# EasyEDA Pro project ProPrj_ProDoc_FPGA_2026-03-24.epro, board 逻辑派_demo
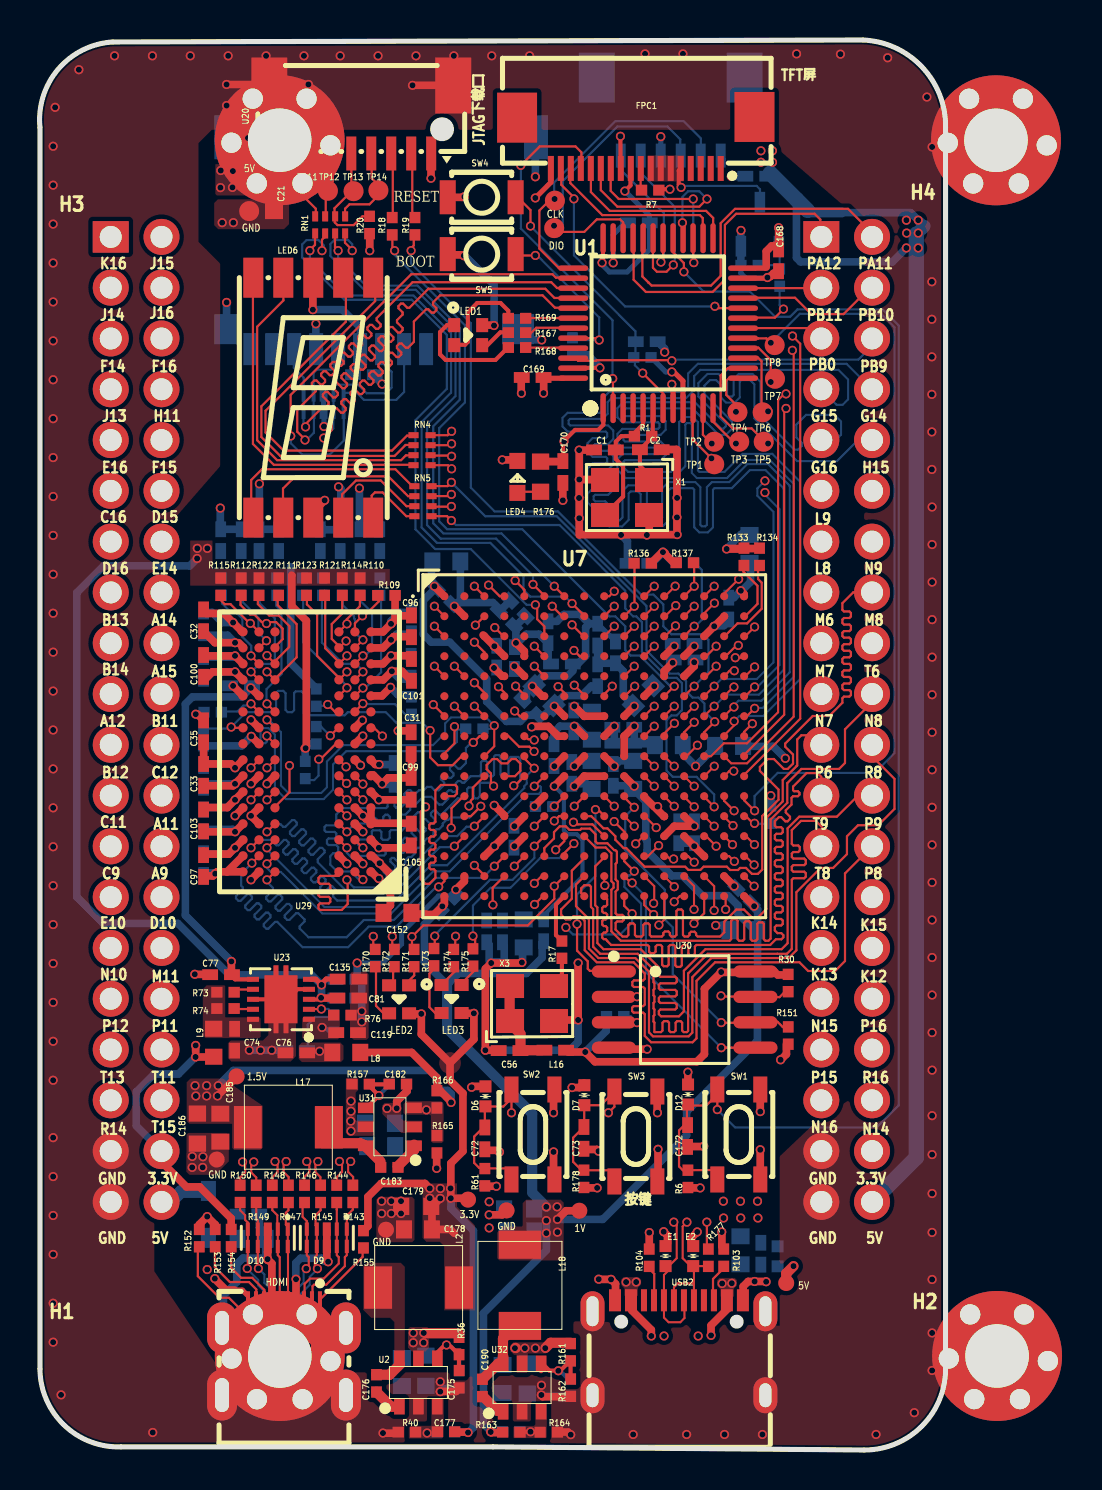
[diagram p11: board, top side]
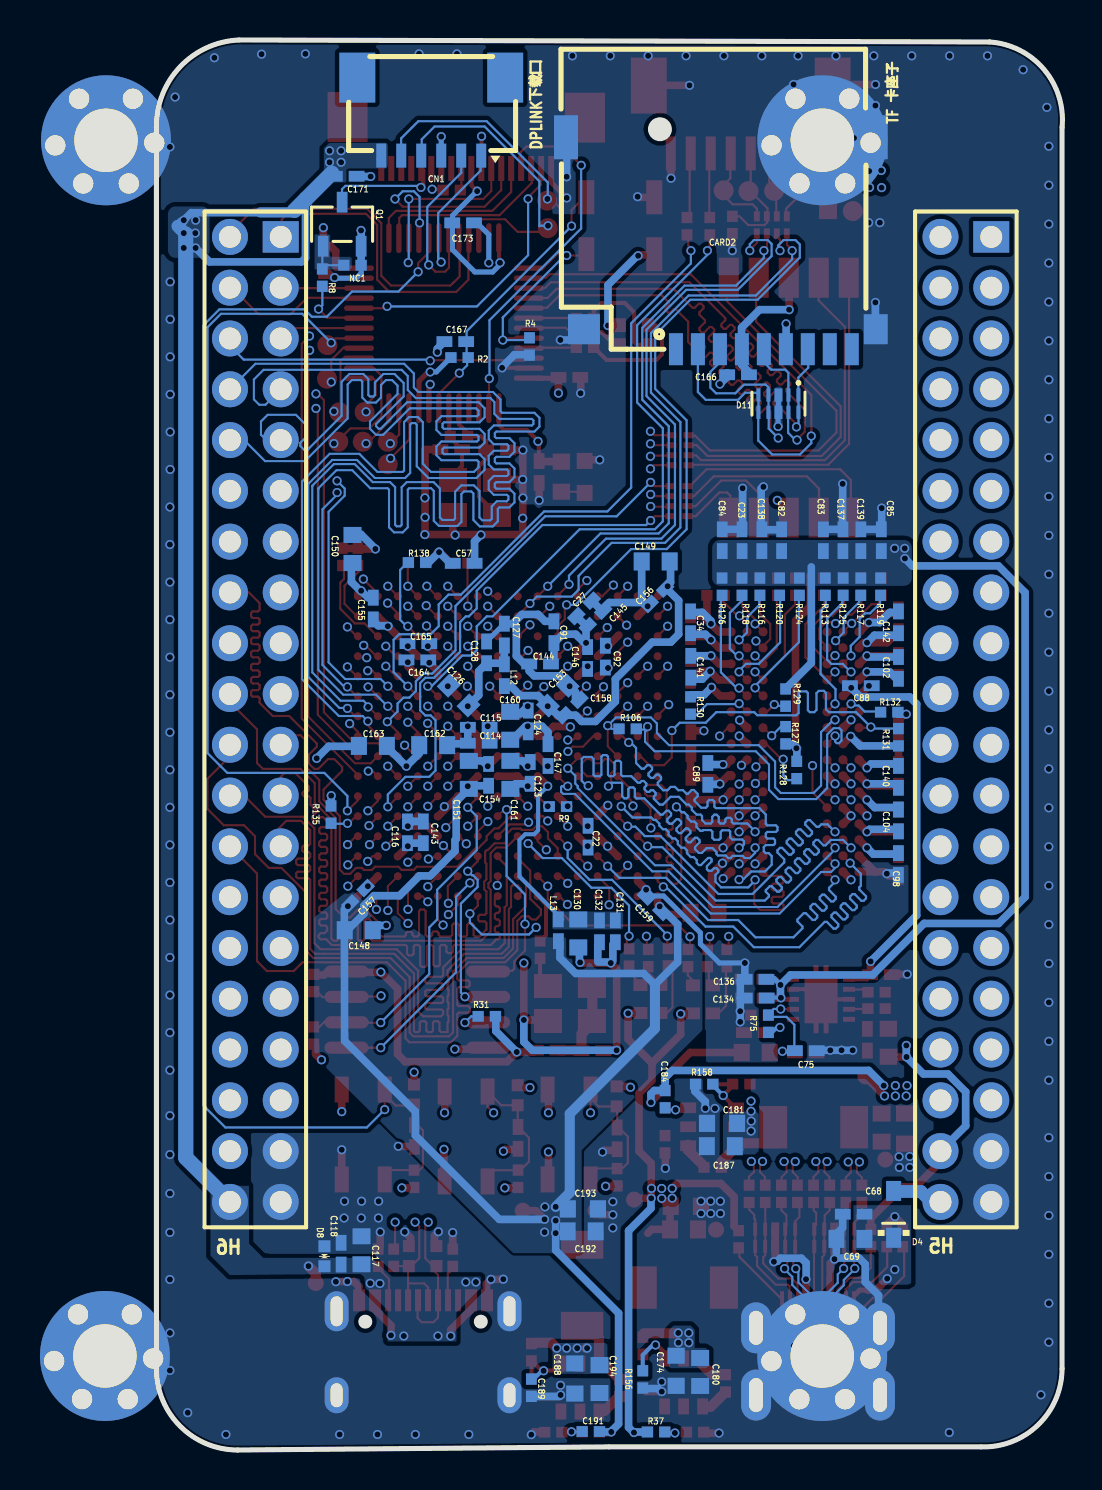
[diagram p12: board, bottom side, seen from below]

Outline 45.32 x 70.52 mm; copper layers: Top Layer, GND02, SIG03, SIG04, POWER05, Bottom Layer. Coordinates in mm from the lower left corner of the outline.
Outline path: 0,66.14 0,4.06 arc(1.2,1.25) 4.05,0.16 22.66,0.16 41.25,0 arc(44.13,1.19) 45.32,4.06 45.32,66.14 arc(44.13,69.17) 41.18,70.52 3.63,70.42 arc(0.91,69.05) 0,66.14
Stack: Top Layer 0.035mm 外层铜厚1oz / Dielectric1 0.0994mm 3313 RC57% 4.2mil / GND02 0.0152mm 内层铜厚 / Dielectric2 0.55mm 0.55mm H/H No copper / SIG03 0.0152mm 内层铜厚 / Dielectric3 0.1088mm 2116 RC54% 4.9mil / SIG04 0.0152mm 内层铜厚 / Dielectric4 0.55mm 0.55mm H/H No copper / POWER05 0.0152mm 内层铜厚 / Dielectric5 0.0994mm 3313 RC57% 4.2mil / Bottom Layer 0.035mm 外层铜厚1oz

## Design rules (mm)
net GND: power
net +5V_IN: power
net +3.3V: power
net VTT_DRAM: power
net +1.5V: power
net HDMI_5V: power
net VREF_DRAM: power
net VCCPLLL: power
net VCCPLLR: power
net +1.0V: power
net PB4/SPI2_MISO: TF_SPI
net PB3/SPI2_SCK: TF_SPI
net PB5/SPI2_MOSI: TF_SPI
net PA15/SPI2_NSS: TF_SPI
net HDMI_DATA2_P: HDMI_DATA2_
net HDMI_DATA2_N: HDMI_DATA2_
net HDMI_DATA1_P: HDMI_DATA1_
net HDMI_DATA1_N: HDMI_DATA1_
net HDMI_DATA0_P: HDMI_DATA0_
net HDMI_DATA0_N: HDMI_DATA0_
net HDMI_CLK_P: HDMI_CLK_
net HDMI_CLK_N: HDMI_CLK_
net M15_IOT40B: USB, USB
net M14_IOT40A: USB, USB
net EX_IOT24B_K16: BANK0, FPGA_IOT24
net EX_IOT24A_J15: BANK0, FPGA_IOT24
net EX_IOT22B_J14: BANK0, FPGA_IOT22
net EX_IOT22A_J16: BANK0, FPGA_IOT22
net EX_IOT9A_F14: BANK0, FPGA_IOT9
net EX_IOT9B_F16: BANK0, FPGA_IOT9
net EX_IOT27B_J13: BANK0, FPGA_IOT27
net EX_IOT27A_H11: BANK0, FPGA_IOT27
net EX_IOT6A_E16: BANK0, FPGA_IOT6
net EX_IOT6B_F15: BANK0, FPGA_IOT6
net EX_IOT5A_C16: BANK0, FPGA_IOT5
net EX_IOT5B_D15: BANK0, FPGA_IOT5
net EX_IOT4A_D16: BANK0, FPGA_IOT4
net EX_IOT4B_E14: BANK0, FPGA_IOT4
net EX_IOL8A_B13: BANK7, FPGA_IOL8
net EX_IOL8B_A14: BANK7, FPGA_IOL8
net EX_IOL2A_B14: BANK7, FPGA_IOL2
net EX_IOL2B_A15: BANK7, FPGA_IOL2
net EX_IOL13B_A12: BANK7, FPGA_IOL13
net EX_IOL13A_B11: BANK7, FPGA_IOL13
net EX_IOL7B_B12: BANK7, FPGA_IOL7
net EX_IOL7A_C12: BANK7, FPGA_IOL7
net EX_IOL15B_C11: BANK7, FPGA_IOL15
net EX_IOL15A_A11: BANK7, FPGA_IOL15
net EX_IOL27B_C9: BANK7, FPGA_IOL27
net EX_IOL27A_A9: BANK7, FPGA_IOL27
net EX_IOL17B_E10: BANK7, FPGA_IOL17
net EX_IOL17A_D10: BANK7, FPGA_IOL17
net EX_IOR27A_N10: BANK2, FPGA_IOR27
net EX_IOR27B_M11: BANK2, FPGA_IOR27
net EX_IOR8A_P12: BANK2, FPGA_IOR8
net EX_IOR24B_P11: BANK2, FPGA_IOR24
net EX_IOR8B_T13: BANK2, FPGA_IOR8
net EX_IOR24A_T11: BANK2, FPGA_IOR24
net EX_IOR7B_R14: BANK2, FPGA_IOR7
net EX_IOR7A_T15: BANK2, FPGA_IOR7
net EX_IOT13A_G15: BANK0, FPGA_IOT13
net EX_IOT13B_G14: BANK0, FPGA_IOT13
net EX_IOT16A_G16: BANK0, FPGA_IOT16
net EX_IOT16B_H15: BANK0, FPGA_IOT16
net EX_IOR40B_L9: BANK3
net EX_IOR44B_L8: BANK3
net EX_IOR36B_N9: BANK3
net EX_IOR44A_M6: BANK3
net EX_IOR36A_M8: BANK3
net EX_IOR47A_M7: BANK3
net EX_IOR53B_T6: BANK3
net EX_IOR47B_N7: BANK3
net EX_IOR40A_N8: BANK3
net EX_IOR53A_P6: BANK3
net EX_IOR29B_R8: BANK3
net EX_IOR38A_T9: BANK3
net EX_IOR38B_P9: BANK3
net EX_IOR42B_T8: BANK3
net EX_IOR42A_P8: BANK3
net EX_IOT30A_K14: BANK1, FPGA_IOT30
net EX_IOT30B_K15: BANK1, FPGA_IOT30
net EX_IOT36A_K13: BANK1, FPGA_IOT36
net EX_IOT36B_K12: BANK1, FPGA_IOT36
net EX_IOT48A_N15: BANK1, FPGA_IOT48
net EX_IOT48B_P16: BANK1, FPGA_IOT48
net EX_IOT54A_P15: BANK1, FPGA_IOT54
net EX_IOT54B_R16: BANK1, FPGA_IOT54
net EX_IOT52A_N16: BANK1, FPGA_IOT52
net EX_IOT52B_N14: BANK1, FPGA_IOT52
net DDR3_CKN: ADDR, DDR3_CK
net DDR3_CKP: ADDR, DDR3_CK
net DDR3_RSTN: ADDR
net DDR3_A13: ADDR
net DDR3_A12: ADDR
net DDR3_A11: ADDR
net DDR3_A10: ADDR
net DDR3_A9: ADDR
net DDR3_A8: ADDR
net DDR3_A7: ADDR
net DDR3_A6: ADDR
net DDR3_A5: ADDR
net DDR3_A4: ADDR
net DDR3_A3: ADDR
net DDR3_A2: ADDR
net DDR3_A1: ADDR
net DDR3_A0: ADDR
net DDR3_BA2: ADDR
net DDR3_BA1: ADDR
net DDR3_BA0: ADDR
net DDR3_CASN: ADDR
net DDR3_RASN: ADDR
net DDR3_WEN: ADDR
net DDR3_CSN: ADDR
net DDR3_CK_EN: ADDR
net LVDS_IOR11_P: LVDS, LVDS_IOR11_
net LVDS_IOR11_N: LVDS, LVDS_IOR11_
net LVDS_IOR17_P: LVDS, LVDS_IOR17_
net LVDS_IOR17_N: LVDS, LVDS_IOR17_
net LVDS_IOR20_P: LVDS, LVDS_IOR20_
net LVDS_IOR20_N: LVDS, LVDS_IOR20_
net LVDS_IOR22_P: LVDS, LVDS_IOR22_
net LVDS_IOR22_N: LVDS, LVDS_IOR22_
net DDR3_DQ5: DQ0-7
net DDR3_DQ6: DQ0-7
net DDR3_LDM: DQ0-7
net DDR3_DQ11: DQ8-15
net DDR3_DQ14: DQ8-15
net DDR3_DQ4: DQ0-7
net DDR3_LDQSP: DQ0-7, DDR3_LDQS
net DDR3_DQ15: DQ8-15
net DDR3_DQ10: DQ8-15
net DDR3_DQ7: DQ0-7
net DDR3_DQ3: DQ0-7
net DDR3_LDQSN: DQ0-7, DDR3_LDQS
net DDR3_DQ13: DQ8-15
net DDR3_DQ8: DQ8-15
net DDR3_ODT: ADDR
net DDR3_DQ2: DQ0-7
net DDR3_DQ9: DQ8-15
net DDR3_DQ12: DQ8-15
net DDR3_DQ1: DQ0-7
net DDR3_DQ0: DQ0-7
net DDR3_UDQSP: DQ8-15, DDR3_UDQS
net DDR3_UDM: DQ8-15
net DDR3_UDQSN: DQ8-15, DDR3_UDQS
template: 自定义配置
spacing copperThickness1oz (default): track to track 0.102, other pairs 0.102 to 0.381
spacing 3W: track to track 0.218, other pairs 0.076 to 0.3
spacing TF: track to track 0.152, other pairs 0 to 0.3
track width 50ohm (default): min 0.109, default 0.109, max 0.508
track width PWOER: min 0.127, default 0.381, max 2.54
differential pair 90ohm: width min 0.102, default 0.102, max 0.109; gap min 0.135, default 0.135
differential pair 100ohm (default): width min 0.104, default 0.104, max 0.104; gap min 0.201, default 0.201
via viaSize (default): diameter min 0.254, default 0.457, max 0.457; hole min 0.178, default 0.305, max 0.305
net class power uses PWOER
net class TF_SPI uses 3W
net class ADDR uses 3W
net class DQ0-7 uses 3W
net class DQ8-15 uses 3W
net GND uses PWOER
net +5V_IN uses PWOER
net +3.3V uses PWOER
net VTT_DRAM uses PWOER
net +1.5V uses PWOER
net HDMI_5V uses PWOER
net VREF_DRAM uses PWOER
net VCCPLLL uses PWOER
net VCCPLLR uses PWOER
net +1.0V uses PWOER
net PB4/SPI2_MISO uses 3W
net PB3/SPI2_SCK uses 3W
net PB5/SPI2_MOSI uses 3W
net PA15/SPI2_NSS uses 3W
net M15_IOT40B uses 90ohm
net M14_IOT40A uses 90ohm
net DDR3_CKN uses 3W
net DDR3_CKP uses 3W
net DDR3_RSTN uses 3W
net DDR3_A13 uses 3W
net DDR3_A12 uses 3W
net DDR3_A11 uses 3W
net DDR3_A10 uses 3W
net DDR3_A9 uses 3W
net DDR3_A8 uses 3W
net DDR3_A7 uses 3W
net DDR3_A6 uses 3W
net DDR3_A5 uses 3W
net DDR3_A4 uses 3W
net DDR3_A3 uses 3W
net DDR3_A2 uses 3W
net DDR3_A1 uses 3W
net DDR3_A0 uses 3W
net DDR3_BA2 uses 3W
net DDR3_BA1 uses 3W
net DDR3_BA0 uses 3W
net DDR3_CASN uses 3W
net DDR3_RASN uses 3W
net DDR3_WEN uses 3W
net DDR3_CSN uses 3W
net DDR3_CK_EN uses 3W
net LVDS_IOR11_P uses LVDS
net LVDS_IOR11_N uses LVDS
net LVDS_IOR17_P uses LVDS
net LVDS_IOR17_N uses LVDS
net LVDS_IOR20_P uses LVDS
net LVDS_IOR20_N uses LVDS
net LVDS_IOR22_P uses LVDS
net LVDS_IOR22_N uses LVDS
net DDR3_DQ5 uses 3W, DQ0_7
net DDR3_DQ6 uses 3W, DQ0_7
net DDR3_LDM uses 3W, DQ0_7
net DDR3_DQ11 uses 3W, DQ8_15
net DDR3_DQ14 uses 3W, DQ8_15
net DDR3_DQ4 uses 3W, DQ0_7
net DDR3_LDQSP uses 3W, DQ0_7
net DDR3_DQ15 uses 3W, DQ8_15
net DDR3_DQ10 uses 3W, DQ8_15
net DDR3_DQ7 uses 3W, DQ0_7
net DDR3_DQ3 uses 3W, DQ0_7
net DDR3_LDQSN uses 3W, DQ0_7
net DDR3_DQ13 uses 3W, DQ8_15
net DDR3_DQ8 uses 3W, DQ8_15
net DDR3_ODT uses 3W
net DDR3_DQ2 uses 3W, DQ0_7
net DDR3_DQ9 uses 3W, DQ8_15
net DDR3_DQ12 uses 3W, DQ8_15
net DDR3_DQ1 uses 3W, DQ0_7
net DDR3_DQ0 uses 3W, DQ0_7
net DDR3_UDQSP uses 3W, DQ8_15
net DDR3_UDM uses 3W, DQ8_15
net DDR3_UDQSN uses 3W, DQ8_15
diff pair USB uses 90ohm
eq len grp LVDS uses LVDS
eq len grp DQ0_7 uses DQ0_7
eq len grp DQ8_15 uses DQ8_15
region e31913 uses TF
region e31914 uses TF

## Placement (name value [footprint] x y rotation side)
C1  18pF  [C0402]  28.27 50.02 180 top
C2  18pF  [C0402]  30.56 50.03 180 top
C21  22uF  [C0603]  11.71 62.66 90 top
C22  100nF  [C0402]  23.72 30.67 270 bottom
C23  100nF  [C0402]  16.01 45.5 90 bottom
C27  100nF  [C0402]  23.92 42.09 315 bottom
C31  100nF  [C0402]  18.57 35.35 90 top
C32  100nF  [C0402]  8.19 41.49 270 top
C33  100nF  [C0402]  8.19 33.76 90 top
C34  100nF  [C0402]  18.59 41.39 270 bottom
C35  100nF  [C0402]  8.19 35.94 270 top
C56  100nF  [C0402]  23.5 19.97 0 top
C57  100nF  [C0402]  29.94 44.34 180 bottom
C68  100nF  [C0402]  10.43 11.79 0 bottom
C69  10uF  [C0603]  10.59 10.56 180 bottom
C72  100nF  [C0402]  22.26 15.58 270 top
C73  100nF  [C0402]  27.22 15.61 270 top
C74  2.2uF  [C0402]  9.74 20.52 270 top
C75  10uF  [C0402]  12.82 19.97 0 bottom
C76  10uF  [C0402]  12.83 19.86 0 top
C77  100nF  [C0402]  9.06 23.77 180 top
C81  2.2uF  [C0402]  15.43 22.6 180 top
C82  2.2uF  [C0402]  14.03 45.5 270 bottom
C83  2.2uF  [C0402]  11.94 45.5 270 bottom
C84  100nF  [C0402]  17 45.5 90 bottom
C85  100nF  [C0402]  9.04 45.5 90 bottom
C88  100nF  [C0402]  10.07 38.22 180 bottom
C89  100nF  [C0402]  17.72 33.81 270 bottom
C91  100nF  [C0402]  25.42 40.9 270 bottom
C92  100nF  [C0402]  22.85 39.68 270 bottom
C96  2.2uF  [C0402]  18.59 41.19 270 top
C97  2.2uF  [C0402]  8.19 29.21 90 top
C98  2.2uF  [C0402]  8.19 29.31 90 bottom
C99  2.2uF  [C0402]  18.57 33.07 270 top
C100  100nF  [C0402]  8.19 39.21 270 top
C101  100nF  [C0402]  18.59 39.01 270 top
C102  100nF  [C0402]  8.19 39.11 270 bottom
C103  100nF  [C0402]  8.19 31.48 270 top
C104  100nF  [C0402]  8.19 31.48 270 bottom
C105  100nF  [C0402]  18.58 30.78 270 top
C114  100nF  [C0402]  29.19 35.35 0 bottom
C115  100nF  [C0402]  29.19 36.14 0 bottom
C116  100nF  [C0402]  32.75 30.89 90 bottom
C117  22uF  [C0603]  35.06 9.99 270 bottom
C118  100nF  [C0402]  36.07 9.82 270 bottom
C119  1nF  [C0402]  15.37 20.87 180 top
C123  100nF  [C0402]  26.61 33.86 270 bottom
C124  100nF  [C0402]  26.71 36.44 90 bottom
C126  10uF  [C0603]  30.19 37.73 225 bottom
C127  1nF  [C0402]  27.91 40.78 270 bottom
C128  100nF  [C0402]  28.8 39.89 270 bottom
C130  10uF  [C0603]  24.21 25.83 90 bottom
C131  1nF  [C0402]  22.35 25.94 90 bottom
C132  100nF  [C0402]  23.15 25.94 90 bottom
C134  10uF  [C0402]  15.33 22.6 180 bottom
C135  10uF  [C0402]  15.44 23.55 180 top
C136  10uF  [C0402]  15.34 23.54 180 bottom
C137  100nF  [C0402]  10.96 45.5 90 bottom
C138  100nF  [C0402]  15.02 45.5 90 bottom
C139  100nF  [C0402]  10.07 45.5 90 bottom
C140  100nF  [C0402]  8.19 33.66 90 bottom
C141  100nF  [C0402]  18.57 39.17 270 bottom
C142  100nF  [C0402]  8.19 41.39 270 bottom
C143  100nF  [C0402]  31.96 30.89 90 bottom
C144  100nF  [C0402]  26.12 39.31 180 bottom
C145  100nF  [C0402]  23.34 41.59 315 bottom
C146  100nF  [C0402]  23.74 39.61 90 bottom
C147  100nF  [C0402]  25.72 34.75 270 bottom
C148  22uF  [C0603]  35.19 26 0 bottom
C149  22uF  [C0603]  20.33 44.44 180 bottom
C150  22uF  [C0603]  35.51 45.06 270 bottom
C151  10uF  [C0603]  29.68 33.76 270 bottom
C152  10uF  [C0603]  17.89 26.86 0 top
C153  10uF  [C0603]  25.23 37.73 315 bottom
C154  100nF  [C0402]  28.69 33.76 270 bottom
C155  100nF  [C0402]  34.47 42.08 90 bottom
C156  100nF  [C0402]  20.25 42.7 135 bottom
C157  100nF  [C0402]  35.23 27.72 315 bottom
C158  100nF  [C0402]  24.53 37.13 315 bottom
C159  100nF  [C0402]  20.44 27.29 225 bottom
C160  22uF  [C0603]  27.61 36.22 90 bottom
C161  22uF  [C0603]  27.6 33.76 270 bottom
C162  10uF  [C0603]  31.47 35.25 180 bottom
C163  10uF  [C0603]  34.49 35.21 0 bottom
C164  100nF  [C0402]  32.26 39.51 0 bottom
C165  100nF  [C0402]  32.21 40.33 180 bottom
C166  100nF  [C0402]  16.21 53.77 180 bottom
C167  100nF  [C0402]  30.36 55.43 180 bottom
C168  100nF  [C0402]  36.96 59.5 90 top
C169  100nF  [C0402]  24.65 53.64 0 top
C170  100nF  [C0402]  26.17 48.91 90 top
C171  100nF  [C0402]  35.84 63.7 0 bottom
C172  100nF  [C0402]  32.41 15.7 90 top
C173  100nF  [C0402]  29.97 61.37 0 bottom
C174  100nF  [R0603_1]  19.31 3.96 90 bottom
C175  100nF  [R0402_1]  20.98 3.54 90 top
C176  100nF  [R0402_1]  16.84 3.33 270 top
C177  22pF  [R0402_1]  20.32 0.92 0 top
C178  22uF  [C0603_1]  18.92 11.03 0 top
C179  100nF  [R0603_1]  18.83 12.19 0 top
C180  10uF  [C0603]  18.11 3.9 90 bottom
C181  100nF  [R0603_1]  17.01 16.34 180 bottom
C182  100nF  [R0402_1]  17.91 18.3 180 top
C183  100nF  [R0402_1]  17.48 14.14 0 top
C184  22pF  [R0402_1]  19.86 17.55 90 bottom
C185  22uF  [C0603_1]  9.03 16.12 90 top
C186  100nF  [R0603_1]  7.88 16.07 90 top
C187  10uF  [C0603]  17.07 15.19 180 bottom
C188  100nF  [R0603_1]  24.38 3.58 90 bottom
C189  100nF  [R0402_1]  26.55 3.12 90 bottom
C190  100nF  [R0402_1]  22.14 3.1 270 top
C191  22pF  [R0402_1]  23.58 0.93 180 bottom
C192  22uF  [C0603_1]  24.04 10.94 0 bottom
C193  100nF  [R0603_1]  23.98 12.06 0 bottom
C194  10uF  [C0603]  23.15 3.55 90 bottom
CARD2  TF PUSH  [TF-SMD_TF-PUSH]  17.07 60.35 0 bottom
CN1  WAFER-100W-6A  [CONN-SMD_6P-P1.00_XUNPU_WAFER-100W-6P]  31.56 66.68 0 bottom
D4  1N5819WS  [SOD-323_L1.8-W1.3-LS2.5-RD]  8.43 11.78 90 bottom
D6  0402ESDA-05N  [D0402-BI]  22.29 17.68 270 top
D7  0402ESDA-05N  [D0402-BI]  27.24 17.74 270 top
D8  0402ESDA-05N  [D0402-BI]  36.91 9.69 270 bottom
D9  RCLAMP0524P  [DFN2510-10_L2.5-W1.0-P0.50-BL]  14.35 10.61 180 top
D10  RCLAMP0524P  [DFN2510-10_L2.5-W1.0-P0.50-BL]  11.4 10.61 180 top
D11  RCLAMP0524P  [DFN2510-10_L2.5-W1.0-P0.50-BL]  14.19 52.33 0 bottom
D12  0402ESDA-05N  [D0402-BI]  32.43 17.78 270 top
E1  0402ESDA-05N  [D0402-BI]  31.3 9.7 270 top
E2  0402ESDA-05N  [D0402-BI]  32.69 9.7 270 top
FPC1  FPC-05F-18PH20  [FPC-SMD_18P-P0.50_FPC-05F-18PH20]  29.81 65.38 180 top
H1  -  [125 X 300]  4.64 4.7 0 top
H2  -  [125 X 300]  40.53 4.7 0 top
H3  -  [125 X 300]  4.63 65.5 0 top
H4  -  [125 X 300]  40.48 65.5 0 top
H5  12251220ANG0S115001  [HDR-TH_40P-P2.54-V-M-R2-C20-S2.54]  4.81 36.54 270 top
H6  12251220ANG0S115001  [HDR-TH_40P-P2.54-V-M-R2-C20-S2.54]  40.37 36.54 270 top
L2  3.3uH  [IND-SMD_L4.4-W4.2]  18.95 8.12 180 top
L8  MPZ1608S101ATAH0  [L0603]  15.33 19.88 0 top
L9  MPZ1608S101ATAH0  [L0603]  8.69 20.37 270 top
L12  UPZ1005D121-1R3TF  [L0402]  27.91 38.75 90 bottom
L13  UPZ1005D121-1R3TF  [L0402]  25.2 25.99 90 bottom
L16  UPZ1005D121-1R3TF  [L0402]  25.78 19.99 180 top
L17  3.3uH  [IND-SMD_L4.4-W4.2]  12.43 16.14 0 top
L18  3.3uH  [IND-SMD_L4.4-W4.2]  24.02 8.23 270 top
LED1  E6C0606RGBC3UDA  [LED-SMD_4P-L1.6-W1.6-TL-FD]  21.43 55.76 0 top
LED2  E6C0606RGBC3UDA  [LED-SMD_4P-L1.6-W1.6-TL-FD]  17.97 22.54 270 top
LED3  E6C0606RGBC3UDA  [LED-SMD_4P-L1.6-W1.6-TL-FD]  20.6 22.55 270 top
LED4  F.0603.00139/P2-0603R1TS2-06T-002  [LED0603-RD]  23.89 48.67 270 top
LED6  SLS0281FR1A1GD  [LED-SEG-SMD_SLS0281FR1A1GD]  13.68 52.63 0 top
NC1  10kΩ  [R0402]  35.51 59.25 0 bottom
Q1  S8050 J3Y  [SOT-23-3_L3.0-W1.7-P0.95-LS2.9-BR]  36.02 61.3 270 bottom
R1  1MΩ  [R0402]  30.18 50.7 180 top
R2  10kΩ  [R0402]  30.15 54.63 0 bottom
R4  10kΩ  [R0402]  26.65 55.19 90 bottom
R6  10kΩ  [R0402]  32.42 13.56 270 top
R7  10Ω  [R0402]  30.54 63.01 0 top
R8  1kΩ  [R0402]  37.02 58.63 270 bottom
R9  10kΩ  [R0402]  25.23 32.18 180 bottom
R17  22Ω  [R0402]  26.12 25.02 90 top
R18  33Ω  [R0402]  17.63 61.2 270 top
R19  33Ω  [R0402]  18.77 61.2 270 top
R20  4.7kΩ  [R0402]  16.49 61.26 90 top
R30  4.7kΩ  [R0402]  37.44 23.35 270 top
R31  4.7kΩ  [R0402]  28.78 21.69 180 bottom
R36  47kΩ  [R0402_1]  20.97 5.2 90 top
R37  15kΩ  [R0402_2]  20.31 0.9 0 bottom
R40  3.3kΩ  [R0402_2]  18.36 0.89 0 top
R61  10kΩ  [R0402]  22.26 13.64 270 top
R73  0Ω  [R0402]  9.28 22.89 0 top
R74  100kΩ  [R0402]  9.28 22.08 0 top
R75  10kΩ  [R0402]  14.69 21.32 90 bottom
R76  10kΩ  [R0402]  15.13 21.75 180 top
R103  5.1kΩ  [R0402]  34.22 9.62 90 top
R104  5.1kΩ  [R0402]  30.49 9.62 90 top
R106  100Ω  [R0402]  21.74 36.06 0 bottom
R109  1kΩ  [R0402]  17.34 42.74 180 top
R110  49.9Ω  [R0402]  16.02 43.17 90 top
R111  49.9Ω  [R0402]  11.94 43.17 90 top
R112  49.9Ω  [R0402]  10.07 43.17 90 top
R113  49.9Ω  [R0402]  11.84 43.17 90 bottom
R114  49.9Ω  [R0402]  15.13 43.17 90 top
R115  49.9Ω  [R0402]  9.04 43.17 90 top
R116  49.9Ω  [R0402]  15.12 43.17 90 bottom
R117  49.9Ω  [R0402]  10.07 43.17 90 bottom
R118  49.9Ω  [R0402]  16.01 43.17 90 bottom
R119  49.9Ω  [R0402]  9.08 43.17 90 bottom
R120  49.9Ω  [R0402]  14.13 43.17 270 bottom
R121  49.9Ω  [R0402]  14.24 43.17 270 top
R122  49.9Ω  [R0402]  10.96 43.17 270 top
R123  49.9Ω  [R0402]  13.34 43.17 270 top
R124  49.9Ω  [R0402]  13.14 43.17 270 bottom
R125  49.9Ω  [R0402]  10.95 43.17 270 bottom
R126  49.9Ω  [R0402]  17.01 43.17 270 bottom
R127  49.9Ω  [R0402]  13.83 35.75 270 bottom
R128  49.9Ω  [R0402]  13.27 34.01 90 bottom
R129  49.9Ω  [R0402]  13.83 37.63 90 bottom
R130  1kΩ  [R0402]  18.59 37.23 270 bottom
R131  1kΩ  [R0402]  8.19 35.65 90 bottom
R132  240Ω  [R0402]  8.65 36.9 0 bottom
R133  4.7kΩ  [R0402]  35.23 44.67 90 top
R134  4.7kΩ  [R0402]  36.01 44.67 90 top
R135  4.7kΩ  [R0402]  36.58 31.78 90 bottom
R136  4.7kΩ  [R0402]  30.16 44.35 180 top
R137  4.7kΩ  [R0402]  32.27 44.37 0 top
R138  4.7kΩ  [R0402]  32.27 44.39 0 bottom
R143  0Ω  [R0402]  15.66 12.81 90 top
R144  0Ω  [R0402]  14.85 12.81 90 top
R145  0Ω  [R0402]  14.04 12.81 90 top
R146  0Ω  [R0402]  13.24 12.81 90 top
R147  0Ω  [R0402]  12.43 12.81 90 top
R148  0Ω  [R0402]  11.63 12.81 90 top
R149  0Ω  [R0402]  10.82 12.81 90 top
R150  0Ω  [R0402]  10.02 12.81 90 top
R151  1kΩ  [R0402]  37.44 20.73 90 top
R152  10kΩ  [R0402]  7.97 10.6 90 top
R153  10kΩ  [R0402]  8.77 10.6 90 top
R154  10kΩ  [R0402]  9.57 10.6 90 top
R155  10kΩ  [R0402]  16.19 10.54 90 top
R156  30kΩ  [R0402_1]  20.98 3.53 90 bottom
R157  47kΩ  [R0402_1]  16.05 18.3 180 top
R158  30kΩ  [R0402_1]  17.91 18.3 180 bottom
R161  47kΩ  [R0402_1]  26.55 4.89 90 top
R162  30kΩ  [R0402_1]  26.56 3.12 90 top
R163  12kΩ  [R0402_2]  23.59 0.89 180 top
R164  18kΩ  [R0402_2]  25.46 0.89 180 top
R165  12kΩ  [R0402_2]  19.87 15.29 90 top
R166  18kΩ  [R0402_2]  19.86 17.54 90 top
R167  3kΩ  [R0402]  23.87 55.88 180 top
R168  4.3kΩ  [R0402]  23.87 55.13 0 top
R169  9.1kΩ  [R0402]  23.87 56.6 0 top
R170  3kΩ  [R0402]  16.77 24.6 270 top
R171  4.3kΩ  [R0402]  18.72 24.6 90 top
R172  9.1kΩ  [R0402]  17.73 24.6 90 top
R173  3kΩ  [R0402]  19.72 24.65 270 top
R174  4.3kΩ  [R0402]  21.67 24.63 90 top
R175  9.1kΩ  [R0402]  20.71 24.6 90 top
R176  4.7kΩ  [R0603]  25.05 48.68 90 top
R177  1.5kΩ  [R0402]  33.45 9.62 90 top
R178  10kΩ  [R0402]  27.22 13.56 270 top
RN1  33Ω  [RES-ARRAY-SMD_0402-8P-L2.0-W1.0-BL]  14.52 61.27 0 top
RN4  510Ω  [RES-ARRAY-SMD_0402-8P-L2.0-W1.0-BL]  19.12 50 270 top
RN5  510Ω  [RES-ARRAY-SMD_0402-8P-L2.0-W1.0-BL]  19.16 47.45 90 top
SW1  PTS815SJK250SMTRLFS  [SW-SMD_4P-L4.2-W3.3-P2.15-LS5.1]  34.97 15.78 90 top
SW2  PTS815SJK250SMTRLFS  [SW-SMD_4P-L4.2-W3.3-P2.15-LS5.1]  24.67 15.78 90 top
SW3  PTS815SJK250SMTRLFS  [SW-SMD_4P-L4.2-W3.3-P2.15-LS5.1]  29.82 15.68 90 top
SW4  B3U-1000P  [KEY-SMD_B3U-1000PM]  22.1 62.65 0 top
SW5  B3U-1000P  [KEY-SMD_B3U-1000PM]  22.1 59.81 180 top
TP1  -  [Test-Point-0.5mm]  33.74 49.3 0 top
TP2  -  [Test-Point-0.5mm]  33.74 50.42 270 top
TP3  -  [Test-Point-0.5mm]  34.99 50.42 0 top
TP4  -  [Test-Point-0.5mm]  34.9 51.91 0 top
TP5  -  [Test-Point-0.5mm]  36.22 50.42 0 top
TP6  -  [Test-Point-0.5mm]  36.16 51.89 0 top
TP7  -  [Test-Point-0.5mm]  36.78 53.57 0 top
TP8  -  [Test-Point-0.5mm]  36.76 55.26 0 top
TP9  -  [Test-Point-0.5mm]  25.73 61.11 0 top
TP10  -  [Test-Point-0.5mm]  25.77 62.48 0 top
TP11  -  [Test-Point-0.5mm]  13.18 62.99 0 top
TP12  -  [Test-Point-0.5mm]  14.41 62.97 0 top
TP13  -  [Test-Point-0.5mm]  15.69 62.96 0 top
TP14  -  [Test-Point-0.5mm]  16.94 62.99 0 top
TP15  -  [Test-Point-0.5mm]  10.47 63.34 0 top
TP16  -  [Test-Point-0.5mm]  10.47 61.96 0 top
U1  GD32F303CBT6  [LQFP-48_L7.0-W7.0-P0.50-LS9.0-BL]  30.93 56.35 0 top
U2  SY8113BADC  [TSOT-23-6_L2.9-W1.6-P0.95-LS2.8-BR]  18.94 3.38 270 top
U7  -  [FBGA-256_L17.0-W17.0-R16-C16-P1.00-TL-1]  27.74 35.2 0 top
U12  -  [测试点0.8mm]  17.31 11.02 0 top
U13  -  [测试点0.8mm]  8.84 14.53 0 top
U14  -  [测试点0.8mm]  23.35 11.98 0 top
U15  -  [测试点0.8mm]  37.34 8.35 0 top
U16  -  [测试点0.8mm]  21.42 12.52 0 top
U17  -  [测试点0.8mm]  9.84 18.69 0 top
U18  -  [测试点0.8mm]  26.99 11.97 0 top
U20  ZX-SH1.0-8PWT  [CONN-SMD_8P-P1.00_MEGASTAR_ZX-SH1.0-8PWT]  16.08 66.54 180 top
U23  TPS51200DRCR  [WSON-10_L3.0-W3.0-P0.50-BL-EP]  12.06 22.54 90 top
U29  MT41J128M16JT-125-K  [FBGA-96_L14.0-W9.0-R16-C6-P0.80-TL]  13.36 34.92 180 top
U30  W25Q64JVSSIQ  [SOP-8_L5.3-W5.3-P1.27-LS8.0-BL]  32.26 22.03 270 top
U31  SY8113BADC  [TSOT-23-6_L2.9-W1.6-P0.95-LS2.8-BR]  17.51 16.16 0 top
U32  SY8113BADC  [TSOT-23-6_L2.9-W1.6-P0.95-LS2.8-BR]  24.13 3.12 270 top
USB2  TYPE-C 16PIN 2MD(073)  [USB-C-SMD_TYPE-C-6PIN-2MD-073]  31.97 5.11 0 top
USB3  -  [hdmi-smd_hdmi-101s]  12.21 5.13 0 top
X1  8MHz  [OSC-SMD_4P-L3.2-W2.5-BL]  29.38 47.64 180 top
X3  50MHz  [OSC-SMD_4P-L3.2-W2.5-BL]  24.62 22.33 0 top

## Footprints (pads in the part's own frame, mm; a bottom-side part is the same pattern mirrored in y, then rotated)
125 X 300
  round 1.016 hole 1.021x1.016: 1(4.95,-0.127) 1(6.017,2.078) 1(6.22,-2.159) 1(8.506,-2.159) 1(8.71,2.078) 1(9.903,-0.254)
  round 6.5 hole 3.18x3.175: 1(7.363,0)
C0402
  rect 0.79x0.54 smd: 1(-0.545,0) 2(0.545,0)
C0603
  rect 0.8x0.9 smd: 1(-0.7,0) 2(0.7,0)
C0603_1
  rect 0.8x0.9 smd: 1(-0.7,0) 2(0.7,0)
CONN-SMD_6P-P1.00_XUNPU_WAFER-100W-6P
  rect 0.5x1.2 smd: 1(-2.5,1.95) 2(-1.5,1.95) 3(-0.5,1.95) 4(0.5,1.95) 5(1.5,1.95) 6(2.5,1.95)
  rect 1.8x2.5 smd: 7(3.7,-1.95) 8(-3.7,-1.95)
CONN-SMD_8P-P1.00_MEGASTAR_ZX-SH1.0-8PWT
  rect 0.5x1.7 smd: 1(-3.5,1.7) 2(-2.5,1.7) 3(-1.5,1.7) 4(-0.5,1.7) 5(0.5,1.7) 6(1.5,1.7) 7(2.5,1.7) 8(3.5,1.7)
  rect 1.8x2.8 smd: 9(4.6,-1.7) 10(-4.6,-1.7)
D0402-BI
  rect 0.6x0.6 smd: 1(-0.5,0) 2(0.5,0)
DFN2510-10_L2.5-W1.0-P0.50-BL
  rect 0.2x0.665 smd: 1(-1,-0.433) 2(-0.5,-0.433) 4(0.5,-0.433) 5(1,-0.433) 6(1,0.433) 7(0.5,0.433) 9(-0.5,0.433) 10(-1,0.433)
  rect 0.4x0.665 smd: 3(0,-0.433) 8(0,0.433)
FBGA-96_L14.0-W9.0-R16-C6-P0.80-TL
  round 0.457 smd: A1(-3.2,6) A2(-2.4,6) A3(-1.6,6) A7(1.6,6) A8(2.4,6) A9(3.2,6) B1(-3.2,5.2) B2(-2.4,5.2) B3(-1.6,5.2) B7(1.6,5.2) B8(2.4,5.2) B9(3.2,5.2) C1(-3.2,4.4) C2(-2.4,4.4) C3(-1.6,4.4) C7(1.6,4.4) C8(2.4,4.4) C9(3.2,4.4) D1(-3.2,3.6) D2(-2.4,3.6) D3(-1.6,3.6) D7(1.6,3.6) D8(2.4,3.6) D9(3.2,3.6) E1(-3.2,2.8) E2(-2.4,2.8) E3(-1.6,2.8) E7(1.6,2.8) E8(2.4,2.8) E9(3.2,2.8) F1(-3.2,2) F2(-2.4,2) F3(-1.6,2) F7(1.6,2) F8(2.4,2) F9(3.2,2) G1(-3.2,1.2) G2(-2.4,1.2) G3(-1.6,1.2) G7(1.6,1.2) G8(2.4,1.2) G9(3.2,1.2) H1(-3.2,0.4) H2(-2.4,0.4) H3(-1.6,0.4) H7(1.6,0.4) H8(2.4,0.4) H9(3.2,0.4) J1(-3.2,-0.4) J2(-2.4,-0.4) J3(-1.6,-0.4) J7(1.6,-0.4) J8(2.4,-0.4) J9(3.2,-0.4) K1(-3.2,-1.2) K2(-2.4,-1.2) K3(-1.6,-1.2) K7(1.6,-1.2) K8(2.4,-1.2) K9(3.2,-1.2) L1(-3.2,-2) L2(-2.4,-2) L3(-1.6,-2) L7(1.6,-2) L8(2.4,-2) L9(3.2,-2) M1(-3.2,-2.8) M2(-2.4,-2.8) M3(-1.6,-2.8) M7(1.6,-2.8) M8(2.4,-2.8) M9(3.2,-2.8) N1(-3.2,-3.6) N2(-2.4,-3.6) N3(-1.6,-3.6) N7(1.6,-3.6) N8(2.4,-3.6) N9(3.2,-3.6) P1(-3.2,-4.4) P2(-2.4,-4.4) P3(-1.6,-4.4) P7(1.6,-4.4) P8(2.4,-4.4) P9(3.2,-4.4) R1(-3.2,-5.2) R2(-2.4,-5.2) R3(-1.6,-5.2) R7(1.6,-5.2) R8(2.4,-5.2) R9(3.2,-5.2) T1(-3.2,-6) T2(-2.4,-6) T3(-1.6,-6) T7(1.6,-6) T8(2.4,-6) T9(3.2,-6)
FBGA-256_L17.0-W17.0-R16-C16-P1.00-TL-1
  round 0.4 smd: A1(-7.5,7.5) A2(-6.5,7.5) A3(-5.5,7.5) A4(-4.5,7.5) A5(-3.5,7.5) A6(-2.5,7.5) A7(-1.5,7.5) A8(-0.5,7.5) A9(0.5,7.5) A10(1.5,7.5) A11(2.5,7.5) A12(3.5,7.5) A13(4.5,7.5) A14(5.5,7.5) A15(6.5,7.5) A16(7.5,7.5) B1(-7.5,6.5) B2(-6.5,6.5) B3(-5.5,6.5) B4(-4.5,6.5) B5(-3.5,6.5) B6(-2.5,6.5) B7(-1.5,6.5) B8(-0.5,6.5) B9(0.5,6.5) B10(1.5,6.5) B11(2.5,6.5) B12(3.5,6.5) B13(4.5,6.5) B14(5.5,6.5) B15(6.5,6.5) B16(7.5,6.5) C1(-7.5,5.5) C2(-6.5,5.5) C3(-5.5,5.5) C4(-4.5,5.5) C5(-3.5,5.5) C6(-2.5,5.5) C7(-1.5,5.5) C8(-0.5,5.5) C9(0.5,5.5) C10(1.5,5.5) C11(2.5,5.5) C12(3.5,5.5) C13(4.5,5.5) C14(5.5,5.5) C15(6.5,5.5) C16(7.5,5.5) D1(-7.5,4.5) D2(-6.5,4.5) D3(-5.5,4.5) D4(-4.5,4.5) D5(-3.5,4.5) D6(-2.5,4.5) D7(-1.5,4.5) D8(-0.5,4.5) D9(0.5,4.5) D10(1.5,4.5) D11(2.5,4.5) D12(3.5,4.5) D13(4.5,4.5) D14(5.5,4.5) D15(6.5,4.5) D16(7.5,4.5) E1(-7.5,3.5) E2(-6.5,3.5) E3(-5.5,3.5) E4(-4.5,3.5) E5(-3.5,3.5) E6(-2.5,3.5) E7(-1.5,3.5) E8(-0.5,3.5) E9(0.5,3.5) E10(1.5,3.5) E11(2.5,3.5) E12(3.5,3.5) E13(4.5,3.5) E14(5.5,3.5) E15(6.5,3.5) E16(7.5,3.5) F1(-7.5,2.5) F2(-6.5,2.5) F3(-5.5,2.5) F4(-4.5,2.5) F5(-3.5,2.5) F6(-2.5,2.5) F7(-1.5,2.5) F8(-0.5,2.5) F9(0.5,2.5) F10(1.5,2.5) F11(2.5,2.5) F12(3.5,2.5) F13(4.5,2.5) F14(5.5,2.5) F15(6.5,2.5) F16(7.5,2.5) G1(-7.5,1.5) G2(-6.5,1.5) G3(-5.5,1.5) G4(-4.5,1.5) G5(-3.5,1.5) G6(-2.5,1.5) G7(-1.5,1.5) G8(-0.5,1.5) G9(0.5,1.5) G10(1.5,1.5) G11(2.5,1.5) G12(3.5,1.5) G13(4.5,1.5) G14(5.5,1.5) G15(6.5,1.5) G16(7.5,1.5) H1(-7.5,0.5) H2(-6.5,0.5) H3(-5.5,0.5) H4(-4.5,0.5) H5(-3.5,0.5) H6(-2.5,0.5) H7(-1.5,0.5) H8(-0.5,0.5) H9(0.5,0.5) H10(1.5,0.5) H11(2.5,0.5) H12(3.5,0.5) H13(4.5,0.5) H14(5.5,0.5) H15(6.5,0.5) H16(7.5,0.5) J1(-7.5,-0.5) J2(-6.5,-0.5) J3(-5.5,-0.5) J4(-4.5,-0.5) J5(-3.5,-0.5) J6(-2.5,-0.5) J7(-1.5,-0.5) J8(-0.5,-0.5) J9(0.5,-0.5) J10(1.5,-0.5) J11(2.5,-0.5) J12(3.5,-0.5) J13(4.5,-0.5) J14(5.5,-0.5) J15(6.5,-0.5) J16(7.5,-0.5) K1(-7.5,-1.5) K2(-6.5,-1.5) K3(-5.5,-1.5) K4(-4.5,-1.5) K5(-3.5,-1.5) K6(-2.5,-1.5) K7(-1.5,-1.5) K8(-0.5,-1.5) K9(0.5,-1.5) K10(1.5,-1.5) K11(2.5,-1.5) K12(3.5,-1.5) K13(4.5,-1.5) K14(5.5,-1.5) K15(6.5,-1.5) K16(7.5,-1.5) L1(-7.5,-2.5) L2(-6.5,-2.5) L3(-5.5,-2.5) L4(-4.5,-2.5) L5(-3.5,-2.5) L6(-2.5,-2.5) L7(-1.5,-2.5) L8(-0.5,-2.5) L9(0.5,-2.5) L10(1.5,-2.5) L11(2.5,-2.5) L12(3.5,-2.5) L13(4.5,-2.5) L14(5.5,-2.5) L15(6.5,-2.5) L16(7.5,-2.5) M1(-7.5,-3.5) M2(-6.5,-3.5) M3(-5.5,-3.5) M4(-4.5,-3.5) M5(-3.5,-3.5) M6(-2.5,-3.5) M7(-1.5,-3.5) M8(-0.5,-3.5) M9(0.5,-3.5) M10(1.5,-3.5) M11(2.5,-3.5) M12(3.5,-3.5) M13(4.5,-3.5) M14(5.5,-3.5) M15(6.5,-3.5) M16(7.5,-3.5) N1(-7.5,-4.5) N2(-6.5,-4.5) N3(-5.5,-4.5) N4(-4.5,-4.5) N5(-3.5,-4.5) N6(-2.5,-4.5) N7(-1.5,-4.5) N8(-0.5,-4.5) N9(0.5,-4.5) N10(1.5,-4.5) N11(2.5,-4.5) N12(3.5,-4.5) N13(4.5,-4.5) N14(5.5,-4.5) N15(6.5,-4.5) N16(7.5,-4.5) P1(-7.5,-5.5) P2(-6.5,-5.5) P3(-5.5,-5.5) P4(-4.5,-5.5) P5(-3.5,-5.5) P6(-2.5,-5.5) P7(-1.5,-5.5) P8(-0.5,-5.5) P9(0.5,-5.5) P10(1.5,-5.5) P11(2.5,-5.5) P12(3.5,-5.5) P13(4.5,-5.5) P14(5.5,-5.5) P15(6.5,-5.5) P16(7.5,-5.5) R1(-7.5,-6.5) R2(-6.5,-6.5) R3(-5.5,-6.5) R4(-4.5,-6.5) R5(-3.5,-6.5) R6(-2.5,-6.5) R7(-1.5,-6.5) R8(-0.5,-6.5) R9(0.5,-6.5) R10(1.5,-6.5) R11(2.5,-6.5) R12(3.5,-6.5) R13(4.5,-6.5) R14(5.5,-6.5) R15(6.5,-6.5) R16(7.5,-6.5) T1(-7.5,-7.5) T2(-6.5,-7.5) T3(-5.5,-7.5) T4(-4.5,-7.5) T5(-3.5,-7.5) T6(-2.5,-7.5) T7(-1.5,-7.5) T8(-0.5,-7.5) T9(0.5,-7.5) T10(1.5,-7.5) T11(2.5,-7.5) T12(3.5,-7.5) T13(4.5,-7.5) T14(5.5,-7.5) T15(6.5,-7.5) T16(7.5,-7.5)
FPC-SMD_18P-P0.50_FPC-05F-18PH20
  rect 0.3x1.25 smd: 1(-4.25,1.288) 2(-3.75,1.288) 3(-3.25,1.288) 4(-2.75,1.288) 5(-2.25,1.288) 6(-1.75,1.288) 7(-1.25,1.288) 8(-0.75,1.288) 9(-0.25,1.288) 10(0.25,1.288) 11(0.75,1.288) 12(1.25,1.288) 13(1.75,1.288) 14(2.25,1.288) 15(2.75,1.288) 16(3.25,1.288) 17(3.75,1.288) 18(4.25,1.288)
  rect 2x2.5 smd: 19(-5.94,-1.288) 20(5.94,-1.252)
hdmi-smd_hdmi-101s
  rect 0.2x0.84 smd: 1(1.8,2.385) 3(1.4,2.385) 5(1,2.385) 7(0.6,2.385) 9(0.2,2.385) 11(-0.2,2.385) 13(-0.6,2.385) 15(-1,2.385) 17(-1.4,2.385) 19(-1.8,2.385)
  rect 0.2x1 smd: 2(1.6,1.165) 4(1.2,1.165) 6(0.8,1.165) 8(0.4,1.165) 10(0,1.165) 12(-0.4,1.165) 14(-0.8,1.165) 16(-1.2,1.165) 18(-1.6,1.165)
  oval 1.5x2.55 hole 0.7x1.7: 20(-3.1,0.975) 20(-3.1,-2.385) 20(3.1,0.975) 20(3.1,-2.385)
HDR-TH_40P-P2.54-V-M-R2-C20-S2.54
  rect 1.575x1.8 hole 1.1: 1(-24.13,-1.27)
  round 1.8 hole 1.1: 2(-24.13,1.27) 3(-21.59,-1.27) 4(-21.59,1.27) 5(-19.05,-1.27) 6(-19.05,1.27) 7(-16.51,-1.27) 8(-16.51,1.27) 9(-13.97,-1.27) 10(-13.97,1.27) 11(-11.43,-1.27) 12(-11.43,1.27) 13(-8.89,-1.27) 14(-8.89,1.27) 15(-6.35,-1.27) 16(-6.35,1.27) 17(-3.81,-1.27) 18(-3.81,1.27) 19(-1.27,-1.27) 20(-1.27,1.27) 21(1.27,-1.27) 22(1.27,1.27) 23(3.81,-1.27) 24(3.81,1.27) 25(6.35,-1.27) 26(6.35,1.27) 27(8.89,-1.27) 28(8.89,1.27) 29(11.43,-1.27) 30(11.43,1.27) 31(13.97,-1.27) 32(13.97,1.27) 33(16.51,-1.27) 34(16.51,1.27) 35(19.05,-1.27) 36(19.05,1.27) 37(21.59,-1.27) 38(21.59,1.27) 39(24.13,-1.27) 40(24.13,1.27)
IND-SMD_L4.4-W4.2
  rect 1.4x2.12 smd: 1(2.028,0) 2(-2.028,0)
KEY-SMD_B3U-1000PM
  rect 0.8x1.7 smd: 1(-1.7,0) 2(1.7,0)
L0402
  rect 0.79x0.54 smd: 1(-0.545,0) 2(0.545,0)
L0603
  rect 0.8x0.864 smd: 1(-0.7,0) 2(0.7,0)
LED0603-RD
  rect 0.8x0.8 smd: 1(-0.799,0) 2(0.799,0)
LED-SEG-SMD_SLS0281FR1A1GD
  rect 1x2 smd: 1(-3,-6) 2(-1.5,-6) 3(0,-6) 4(1.5,-6) 5(3,-6) 6(3,6) 7(1.5,6) 8(0,6) 9(-1.5,6) 10(-3,6)
LED-SMD_4P-L1.6-W1.6-TL-FD
  rect 0.6x0.7 smd: 1(-0.7,0.5) 2(0.7,0.5) 3(-0.7,-0.5) 4(0.7,-0.5)
LQFP-48_L7.0-W7.0-P0.50-LS9.0-BL
  oval 0.27x1.5 smd: 1(-2.75,-4.25) 2(-2.25,-4.25) 3(-1.75,-4.25) 4(-1.25,-4.25) 5(-0.75,-4.25) 6(-0.25,-4.25) 7(0.25,-4.25) 8(0.75,-4.25) 9(1.25,-4.25) 10(1.75,-4.25) 11(2.25,-4.25) 12(2.75,-4.25) 25(2.75,4.25) 26(2.25,4.25) 27(1.75,4.25) 28(1.25,4.25) 29(0.75,4.25) 30(0.25,4.25) 31(-0.25,4.25) 32(-0.75,4.25) 33(-1.25,4.25) 34(-1.75,4.25) 35(-2.25,4.25) 36(-2.75,4.25)
  oval 1.5x0.27 smd: 13(4.25,-2.75) 14(4.25,-2.25) 15(4.25,-1.75) 16(4.25,-1.25) 17(4.25,-0.75) 18(4.25,-0.25) 19(4.25,0.25) 20(4.25,0.75) 21(4.25,1.25) 22(4.25,1.75) 23(4.25,2.25) 24(4.25,2.75) 37(-4.25,2.75) 38(-4.25,2.25) 39(-4.25,1.75) 40(-4.25,1.25) 41(-4.25,0.75) 42(-4.25,0.25) 43(-4.25,-0.25) 44(-4.25,-0.75) 45(-4.25,-1.25) 46(-4.25,-1.75) 47(-4.25,-2.25) 48(-4.25,-2.75)
OSC-SMD_4P-L3.2-W2.5-BL
  rect 1.4x1.2 smd: 1(-1.1,-0.875) 2(1.1,-0.875) 3(1.1,0.875) 4(-1.1,0.875)
R0402
  rect 0.566x0.54 smd: 1(-0.433,0) 2(0.433,0)
R0402_1
  rect 0.566x0.54 smd: 1(-0.433,0) 2(0.433,0)
R0402_2
  rect 0.566x0.54 smd: 1(-0.433,0) 2(0.433,0)
R0603
  rect 0.806x0.864 smd: 1(-0.753,0) 2(0.753,0)
R0603_1
  rect 0.806x0.864 smd: 1(-0.753,0) 2(0.753,0)
RES-ARRAY-SMD_0402-8P-L2.0-W1.0-BL
  rect 0.3x0.505 smd: 1(-0.75,0.427) 2(-0.25,0.427) 3(0.25,0.427) 4(0.75,0.427) 5(0.75,-0.427) 6(0.25,-0.427) 7(-0.25,-0.427) 8(-0.75,-0.427)
SOD-323_L1.8-W1.3-LS2.5-RD
  rect 1x0.75 smd: 1(-1.173,0) 2(1.173,0)
SOP-8_L5.3-W5.3-P1.27-LS8.0-BL
  oval 0.609x2.204 smd: 1(-1.905,-3.542) 2(-0.635,-3.542) 3(0.635,-3.542) 4(1.905,-3.542) 5(1.905,3.542) 6(0.635,3.542) 7(-0.635,3.542) 8(-1.905,3.542)
SOT-23-3_L3.0-W1.7-P0.95-LS2.9-BR
  rect 1.038x0.532 smd: 1(1.101,-0.95) 2(1.101,0.95) 3(-1.101,0)
SW-SMD_4P-L4.2-W3.3-P2.15-LS5.1
  rect 1.3x0.7 smd: 1(-2.25,1.075) 2(2.25,1.075) 3(-2.25,-1.075) 4(2.25,-1.075)
Test-Point-0.5mm
  round 1 smd: 1(0,0)
TF-SMD_TF-PUSH
  rect 0.7x1.6 smd: 1(2.25,5.3) 2(1.15,5.3) 3(0.05,5.3) 4(-1.05,5.3) 5(-2.15,5.3) 6(-3.25,5.3) 7(-4.35,5.3) 8(-5.45,5.3) CD(-6.55,5.3)
  rect 1.2x1.5 smd: 10(-7.75,4.3)
  rect 1.2x2.2 smd: 11(-7.75,-5.3) 12(7.75,-5.3)
  rect 1.6x1.5 smd: 13(6.85,4.3)
TSOT-23-6_L2.9-W1.6-P0.95-LS2.8-BR
  rect 0.8x0.532 smd: 1(1.2,-0.95) 2(1.2,0) 3(1.2,0.95) 4(-1.2,0.95) 5(-1.2,0) 6(-1.2,-0.95)
USB-C-SMD_TYPE-C-6PIN-2MD-073
  rect 0.6x1.1 smd: 1(-3.2,2.375) 2(-2.4,2.375) 11(2.4,2.375) 12(3.2,2.375)
  rect 0.3x1.1 smd: 3(-1.75,2.375) 4(-1.25,2.375) 5(-0.75,2.375) 6(-0.25,2.375) 7(0.25,2.375) 8(0.75,2.375) 9(1.25,2.375) 10(1.75,2.375)
  oval 1.2x2 hole 0.6x1.5: 13(-4.325,1.825) 14(4.325,1.825)
  oval 1.2x1.8 hole 0.6x1.2: 13(-4.325,-2.375) 14(4.325,-2.375)
WSON-10_L3.0-W3.0-P0.50-BL-EP
  rect 0.25x0.6 smd: 1(-1.001,-1.4) 2(-0.5,-1.4) 3(0,-1.4) 4(0.5,-1.4) 5(1.001,-1.4) 6(1.001,1.4) 7(0.5,1.4) 8(0,1.4) 9(-0.5,1.4) 10(-1.001,1.4)
  custom 3.4x1.65 smd: 11(0,0)
测试点0.8mm
  round 0.8 smd: 1(0,0)

## Nets
As in the schematic.

Pads without a net: CARD2 1 8 CD; CN1 7 8; FPC1 1 2 3 4 19 20; H6 12; U1 3 4; U7 A2 A8 A10 B4 B5 B6 C2 C5 C7 D1 D2 D7 D9 E3 E7 E8 E9 E11 F1 F2 G4 G6 H1 H2 H6 J4 J6 K1 K2 L3 L4 L5 M1 N1 N3 P1 P2 R5 T2 T3 T4 T5; U29 J1 J9 L1 L9 M7 T7; USB2 3 9; USB3 2

## Via types
v1: diameter 0.457, hole 0.305, Top Layer to Bottom Layer, 665 vias

## Routing (per net, layer and track width the routed paths; a pad name or vN(x,y) marks a point on that pad's centre or on a via; arc(x,y) is an arc through that point)
+1.0V: length 120.7
  Top Layer w0.381: 18.5,26.8 19.3,26.8 ; U7.T16 v1(35.74,27.2) ; 22.53,0.93 22.6,0.87 23.12,0.87 ; U7.K10 v1(29.74,33.2) ; U18.1 26.33,11.97 v1(25.89,11.53) ; 19.32,26.78 19.73,26.78 v1(20.13,27.19) 20.24,27.29 U7.T1 ; 35.06,42.98 35.23,42.81 35.23,42.69 ; U7.A1 v1(19.74,43.2) ; U7.G7 v1(25.74,37.2)
  POWER05 w0.254: 32.25,30.85 32.44,30.65 32.93,30.65 33.19,30.39 33.19,30.03 34.24,28.98 34.6,28.98 35.28,28.3 35.28,28.01 35.71,27.58 35.71,27.2 ; 34.35,39.91 34.09,39.65 33.65,39.65 33.19,39.2 33.19,38.01 32.93,37.74 32.55,37.74 32.22,37.41 32.22,30.87 ; 34.39,39.95 34.39,42.27 35.08,42.97
  POWER05 w0.381: 29.69,33.18 28.88,33.18 26.19,35.87 26.19,36.8 25.75,37.24
  Bottom Layer w0.381: 19.75,43.22 19.59,43.39 19.59,44.38 ; v1(25.34,11.47) v1(25.34,10.85) 25.34,9.99 22.19,6.84 22.19,1.3 22.57,0.92 ; C151.2 30.32,32.43 30.32,30.56 30.38,30.5 30.38,29.96 31.62,28.71 32.16,28.71 33.15,27.72 34.44,27.72 34.93,27.22 34.93,26.82 35.91,25.84 ; 35.91,25.84 35.91,27.04 35.76,27.19 ; 35.91,25.84 35.9,20.47 32.36,16.92 32.36,15.73 28.16,11.53 v1(25.89,11.53) ; v1(29.74,33.2) 29.78,33.16 ; 35.18,43.03 35.56,43.41 35.56,44.23 ; 25.24,36.75 C153.2 26.22,37.73 27.11,37.73 27.58,38.2 L12.1 ; 25.12,36.75 24.35,36.75 24.04,36.44 23.34,36.44 22.35,37.43 22.35,38.55 20.5,40.4 19.58,40.4 19.18,40.8 19.18,42.48 19.74,43.03 v1(19.74,43.2) 19.78,43.24 ; 23.16,0.9 v1(22.55,0.9) ; 25.13,25.33 25.13,24.62 24.34,23.83 20.94,23.83 20.37,23.26 19.24,24.4 19.24,26.29 v1(20.13,27.19) 20.13,26.99 C159.2 ; 34.47,42.63 34.73,42.63 v1(35.07,42.97) ; C154.2 29.72,33.22
  Bottom Layer w0.508: 20.37,23.26 20.37,21.08 24.63,16.82 24.63,12.87 v1(25.34,12.16)
  vias: v1(25.88,12.16) v1(25.89,10.9)
+1.5V: length 69.1
  Top Layer w0.381: 16.96,30.12 18.33,30.12 18.59,30.37 ; 16.96,30.12 16.94,30.1 ; 16.96,30.12 U29.C1 ; U29.R1 17.17,40.12 17.53,40.48 17.7,40.68 18.56,40.68 ; v1(20.57,17.38) 20.57,17.42 20.04,17.95 19.86,17.95 ; v1(22.73,32.24) 23.24,31.73 U7.M4 ; U29.B2 v1(16.16,29.32) ; U7.E4 23.13,38.7 v1(22.72,39.11) ; v1(9.76,40.37) 8.75,40.37 8.33,40.8 ; R166.2 19.86,18.62 18.6,19.88 L8.2 ; 9.86,18.69 v1(8.88,17.71) ; v1(17.92,35.97) 18.5,35.97 C31.2 ; C101.2 18.11,38.95 v1(17.61,38.95) 17.18,38.52 U29.N1 ; U29.A8 v1(10.56,28.52) ; U7.J7 v1(25.74,34.2) ; v1(16.96,28.58) 16.92,28.58 16.56,28.94 ; 8.19,29.95 8.34,29.8 9.45,29.8 v1(9.76,30.12) U29.C9 ; U29.K2 15.76,36.13 v1(16.13,36.5) ; U29.D9 v1(9.76,30.92) 8.31,30.92 8.19,31.04 ; U29.K8 v1(10.56,36.52) ; U29.E9 v1(9.76,31.72) ; U29.F1 v1(16.96,32.52) 18.57,32.52 C99.2 ; U29.H9 v1(9.76,34.12) 9.57,34.31 C33.2 C35.2 ; v1(24.6,36.16) 24.63,36.19 25.44,36.19 25.93,35.7 U7.H7 ; U29.G7 v1(11.36,33.32) ; U29.N9 v1(9.76,38.92) 8.63,38.92 8.29,38.57 ; 10.17,40.15 9.94,40.37 ; U7.D5 24.24,39.95 v1(23.82,40.37) ; U29.D2 v1(16.16,30.92) ; U29.H2 15.77,34.52 v1(16.04,34.24)
  POWER05 w0.254: v1(16.04,34.24) 16.65,33.63 16.65,32.82 v1(16.96,32.52)
  Bottom Layer w0.381: 8.93,18.24 9.67,18.98 19.5,18.98 19.86,18.62 C184.2 20.41,17.98 20.57,17.81 v1(20.57,17.38) ; 18.49,38.55 18.01,38.55 v1(17.61,38.95) ; v1(9.76,30.12) 9.45,29.8 8.34,29.8 8.19,29.95 ; 8.29,38.57 8.63,38.92 v1(9.76,38.92) ; C27.2 23.83,41.23 23.83,41.22 23.82,41.21 v1(23.82,40.37) 23.9,40.37 24.34,40.8 24.98,40.8 C91.2 25.42,39.46 C144.2 ; v1(17.57,40.52) 17.85,40.8 18.44,40.8 ; 8.29,40.75 9.39,40.75 v1(9.76,40.37) ; v1(9.76,34.12) 9.57,34.31 C33.2 ; v1(9.76,30.92) 9.64,31.04 8.19,31.04
  vias: v1(7.76,18.22) v1(7.8,17.71) v1(8.34,18.22) v1(8.34,17.71) v1(8.92,18.22) v1(16.96,30.12)
+3.3V: length 149.7
  Top Layer w0.203: 26.18,50.32 26.18,49.7 ; v1(31.52,63.05) 31.08,63.05 31.04,63.01 ; v1(29.27,62.96) 29.55,63.24 29.55,63.66 ; v1(28.13,59.37) 28.17,59.42 28.17,60.06 ; 28.19,51.56 28.19,51.27 27.94,51.02 26.77,51.02 26.19,50.43 ; 30.97,63.05 31.02,63.05
  Top Layer w0.254: 32.17,52.67 32.17,53.46 31.72,53.92 v1(31.62,53.92) ; 26.23,53.6 25.2,53.6 ; 35.88,59.11 36.28,59.11 36.34,59.16 ; 25.15,53.6 25.15,53.6
  Top Layer w0.381: 20.72,10.84 20.53,11.03 C178.2 19.62,12.17 v1(20.03,12.58) ; 13.66,58.77 v1(13.66,57.03) ; 31.13,44.9 30.57,44.34 ; 13.66,47.19 13.94,47.19 v1(14.25,47.49) ; 22.12,56.26 22.7,56.26 v1(22.72,56.24) ; v1(21.42,0.87) 21.4,0.9 20.73,0.9 ; 22.17,13.19 v1(22.84,13.19) ; 20.39,59.77 21.17,59.77 v1(21.21,59.73) ; v1(27.88,13.11) 27.23,13.11 27.22,13.09 ; 34.07,23.89 33.25,23.07 33.25,19.8 32.87,19.42 27.77,19.42 v1(27.28,19.9) 26.44,19.9 26.36,19.98 ; 34.07,23.89 35.14,23.89 35.14,23.89 ; 34.07,23.89 v1(34.09,23.9) ; v1(29.74,36.2) U7.H10 U7.J10 ; 9.57,11.03 9.57,11.58 7.99,13.16 7.33,13.16 6.08,14.41 H5.38 ; 31.28,44.87 31.26,44.84 31.73,44.37 31.87,44.37 ; 36.91,60.21 36.61,60.21 36.34,59.94 36.34,59.16 ; U7.E13 32.74,39.2 v1(32.74,39.4) ; 36.96,60.19 v1(36.96,61.13) ; 37.34,23.79 37.31,23.76 36.92,23.76 36.74,23.93 U30.8 ; 25.12,49.43 26.13,49.43 26.16,49.47 ; U7.K9 U7.K8 v1(26.74,33.2) ; 18.48,21.81 19.08,21.81 v1(19.08,21.81) 19.08,20.79 20.52,19.35 ; v1(19.51,13.08) 19.26,13.33 17.08,13.33 16.41,12.66 16.41,11.19 R155.2 ; 21.17,21.84 v1(21.71,21.84) 21.71,20.54 20.52,19.35 ; U16.1 21.35,12.59 v1(20.56,12.59) 20.56,14.34 21.17,14.94 21.17,17.84 20.52,18.48 20.52,19.35 ; U7.N12 31.74,31.2 v1(32.74,31.2) U7.M13 ; U7.G9 U7.G8 v1(26.74,37.2) ; 7.79,19.92 v1(7.79,20.23) ; 25.2,53.51 25.2,52.86 ; v1(33.03,13.11) 32.4,13.11 32.38,13.13 ; 31.24,44.86 31.26,44.86 ; 7.8,19.64 v1(7.78,19.66) 8.68,19.66 L9.2 ; U7.N5 v1(23.74,30.2) ; U7.D12 v1(31.74,40.2)
  POWER05 w0.254: 30.08,33.96 30.08,33.86 30.26,33.68 30.26,32.86 30.06,32.65 27.28,32.65 v1(26.74,33.2) 26.19,32.65 25.5,32.65 25.23,32.38 25.23,30.99 24.97,30.74 24.28,30.74 v1(23.74,30.2) ; 32.68,31.2 32.84,31.2 33.22,31.58 33.22,32.46 33.28,32.52
  POWER05 w0.381: v1(32.74,39.4) 32.54,39.4 v1(31.74,40.2) ; 33.28,32.52 33.66,32.9 34.98,32.9 36.65,34.57 37.31,34.57 ; 30.08,33.96 30.08,35.85 v1(29.74,36.2) ; v1(31.17,44.9) 31.26,44.81 31.26,40.71 31.25,40.69 31.78,40.16
  Bottom Layer w0.254: 29.28,62.96 29.29,62.95 ; 29.29,62.95 30.5,61.74 30.5,61.42 ; 29.29,62.95 29.29,62.99 ; 28.02,59.38 28.49,58.91 29.38,58.91 30.5,60.03 30.5,61.32 ; 30.61,54.61 31.31,53.92 v1(31.62,53.92)
  Bottom Layer w0.381: 35.09,35.19 35.18,35.19 ; 35.18,35.19 36.7,35.19 v1(37.3,34.59) ; 35.18,35.19 35.18,35.2 ; C161.2 27.35,33.32 26.71,33.32 ; v1(27.28,19.9) 28.33,20.95 28.33,21.66 ; v1(21.42,0.87) 21.39,0.9 R37.2 ; v1(22.72,56.24) 22.72,58.26 21.27,59.72 ; 15.67,53.91 16.02,54.27 16.02,55.05 16.04,55.07 16.04,56.13 15.13,57.03 v1(13.66,57.03) ; C114.2 29.74,35.35 v1(29.74,36.2) ; 32.06,31.44 32.5,31.44 v1(32.74,31.2) ; 27.61,36.82 27.11,36.82 v1(26.74,37.2) ; 30.46,44.36 30.63,44.36 31.17,44.9 ; 31.17,44.91 31.17,44.95 ; 30.67,35.25 30.6,35.32 29.71,35.32 ; R138.1 31.69,44.39 v1(31.17,44.9) ; 21.21,59.72 v1(21.21,59.73) ; 20.57,12.54 20.57,12.09 21.69,10.97 21.69,1.13 21.43,0.87 ; H5.38 4.82,16.21 4.82,17.91 5.71,18.81 6.94,18.81 v1(7.78,19.66) 7.79,19.66 v1(7.79,20.23)
  vias: v1(19.51,12.6) v1(20.03,13.08) v1(20.55,13.08) v1(25.2,52.85) v1(26.22,50.44)
+5V_IN: length 78.1
  Top Layer w0.381: 29.62,7.17 29.62,6.98 30.59,6.01 30.59,5.71 ; 37.34,8.33 37.34,8.35 ; 25.28,5.09 25.28,5.08 ; 34.44,7.08 34.43,7.08 33.58,6.23 v1(33.58,5.73)
  Top Layer w0.508: 12.57,64.28 12.57,63.86 11.92,63.21 ; 23.81,5.1 23.8,5.11 ; 20.93,5.84 19.31,5.84 ; U15.1 37.34,8.83 v1(37.71,9.2) ; 25.3,5.11 25.55,5.36 26.55,5.36
  Bottom Layer w0.381: 44.05,61.4 43.57,61.88 40.27,61.88 ; v1(43.35,60.12) 42.66,59.42 38.05,59.42 37.86,59.62 37.86,62.54 ; 34.12,64.53 34.06,64.47
  Bottom Layer w0.508: 38.4,61.89 40.11,61.89 ; 44.05,61.4 44.25,61.2
  Bottom Layer w0.635: 6.75,12.62 7.06,12.93 8.48,12.93 ; 44.25,61.2 43.85,60.81
  Bottom Layer w0.762: 43.85,60.81 43.85,14.62 H6.40 ; 36.54,63.86 38.4,62
  vias: v1(9.05,63.99) v1(9.03,63.13) v1(9.65,63.96) v1(9.63,63.14) v1(15.56,17.45) v1(15.56,16.94) v1(15.55,16.45) v1(15.56,15.95) v1(18.68,5.86) v1(18.68,5.37) v1(19.2,5.86) v1(19.2,5.37) v1(23.77,5.09) v1(24.26,5.09) v1(24.79,5.09) v1(25.28,5.09) v1(29.33,8.4) v1(29.83,8.4) v1(30.59,5.7) v1(31.23,5.7) v1(32.94,5.7) v1(34.14,8.33) v1(34.62,8.34) v1(36.08,64.97) v1(36.08,64.4) v1(36.65,64.97) v1(36.66,64.4) v1(43.35,61.5) v1(43.37,60.86) v1(43.95,61.5) v1(43.95,60.86) v1(43.95,60.12)
GND: length 533.1
  Top Layer w0.203: v1(28.68,59.37) 28.68,59.38 28.68,61.09 ; 13.4,23.05 12.88,23.05 12.38,22.55 ; 29.05,64.51 v1(29.05,65.7) ; 27.14,54.12 v1(28.02,54.12) ; 10.68,22.54 11.68,22.54
  Top Layer w0.254: 31.59,53.29 31.68,53.2 U1.8 ; v1(24.79,62.62) 25.57,63.4 25.57,63.71 ; 36.37,58.6 35.88,58.6
  Top Layer w0.381: 14.37,10 14.35,9.99 14.35,9.47 14.42,9.4 ; v1(11.39,9.54) 11.39,9.48 ; v1(11.39,9.54) 11.39,9.55 11.39,9.92 ; v1(11.39,9.54) 11.6,9.33 11.6,8.56 ; v1(33.21,15.19) 33.2,15.18 32.39,15.18 ; U7.E12 31.24,38.95 v1(31.66,39.37) ; U7.B2 v1(20.74,42.2) ; v1(22.48,11.76) 23.13,11.76 U14.1 ; 36.47,58.68 36.54,58.68 36.71,58.85 36.91,58.85 ; U29.T1 17.17,40.92 v1(17.57,41.32) 17.57,41.32 ; 17.57,41.32 17.77,41.52 R109.1 ; 17.57,41.32 17.58,41.32 17.59,41.32 17.99,41.72 18.59,41.72 ; 25.91,0.9 26.43,0.9 v1(26.56,0.77) ; U29.P9 v1(9.76,39.72) 8.34,39.72 ; 11.51,68.29 13.43,68.29 v1(13.43,68.29) ; v1(33.74,41.2) U7.C14 ; v1(16.5,59.98) 16.5,60.82 R20.1 ; U7.R2 21.24,28.45 v1(20.81,28.02) ; 8.24,39.72 C102.1 ; 19.99,2.93 20.82,2.93 21.02,3.12 ; U7.F11 v1(30.74,38.2) ; 21.14,62.66 21.13,62.65 20.56,62.65 ; 27.01,50.01 27.72,50.01 ; 25.7,17.81 v1(25.7,16.87) ; 30.49,46.7 30.49,45.94 30.4,45.86 ; U29.A9 9.36,28.92 ; 9.36,28.92 8.86,28.92 v1(8.77,28.82) 8.66,28.71 8.34,28.71 8.19,28.86 ; 9.36,28.92 U29.B9 ; v1(34.12,10.9) 34.12,10.9 34.12,10.17 ; 22.79,30.19 22.73,30.19 22.22,29.68 ; 18.57,33.62 17.43,33.62 v1(17.12,33.31) 16.68,33.76 16.54,33.76 ; 16.56,31.54 U29.E1 ; 16.56,31.54 16.33,31.54 v1(16.16,31.72) U29.E2 ; 16.56,31.54 16.76,31.34 18.32,31.34 ; 16.56,31.54 U29.D1 ; U29.E8 v1(10.56,31.72) U29.D8 ; v1(32.89,10.91) 32.6,10.62 32.6,10.35 ; 33.25,29.67 32.73,30.19 32.73,30.2 ; 8.19,32.13 9.37,32.13 v1(9.76,32.52) U29.F9 ; U29.J8 10.95,35.32 v1(10.58,35.69) ; U7.D13 v1(32.74,40.2) ; 30.93,13.71 v1(30.93,15.04) ; 26.99,48.51 27.01,48.53 28.08,48.53 ; 26.99,48.51 v1(26.99,48.54) 26.99,50.01 27.01,50.03 ; 26.99,48.51 26.99,45.76 ; 11.34,68.29 v1(9.34,68.29) ; 31.1,50.04 31.86,50.04 31.87,50.02 v1(31.87,46.64) 31.87,45.97 ; 37.06,19.5 37.35,19.8 37.35,20.29 ; U29.M1 17.12,37.72 v1(17.54,38.14) ; v1(36.04,16.92) 36.04,18.03 ; v1(27.95,14.94) 27.87,15.03 27.21,15.03 ; v1(19.57,63.6) 19.57,64.45 19.56,64.45 ; v1(16.15,35.71) 15.76,35.32 U29.J2 ; U7.H9 v1(28.74,36.2) ; v1(26.93,24.35) v1(26.93,21.51) 25.78,21.51 25.58,21.31 ; 22.7,40.22 22.7,40.24 22.18,40.76 ; D9.3 D9.8 ; 19.85,14.89 v1(19.85,14.09) ; 12.22,6.02 v1(12.22,5.21) ; U7.F6 25.14,37.7 v1(24.64,38.2) ; 24.12,24.35 v1(22.58,24.35) 22.29,24.06 v1(22.29,19.99) 22.7,19.99 22.73,20.02 ; 22.28,18.18 21.64,18.18 v1(21.6,18.14) ; 30.75,32.16 31.23,31.68 31.24,31.68 ; 10.07,40.94 10.07,40.97 v1(9.66,41.38) 9.21,41.84 8.29,41.84 ; U29.G9 v1(9.76,33.32) 9.66,33.22 C33.1 ; v1(32.74,30.2) U7.N13 ; 27.22,18.36 26.99,18.13 v1(26.62,18.13) ; 11.01,6.04 v1(11.01,5.21) ; v1(27.96,8.54) 27.97,8.53 v1(28.58,8.53) 28.8,8.31 28.8,7.57 ; 34.34,45.06 34.36,45.08 35.94,45.08 ; 26.54,2.67 25.16,2.67 25.06,2.76 ; D10.3 D10.8 ; v1(34.36,45.06) 35.27,45.06 ; 34.25,41.69 33.77,41.21 33.72,41.21 ; 30.71,32.19 30.24,32.66 U7.L11 ; 30.88,17.63 30.88,16.88 v1(30.9,16.87) ; 17.15,26.85 17.54,27.24 17.54,28.8 v1(16.99,29.35) 16.62,29.72 U29.B1 ; v1(31.89,45.78) 27.01,45.78 ; U7.D4 v1(22.74,40.2) ; 11.61,7.82 11.61,8.52 ; U29.G8 v1(10.56,33.32) ; v1(7.75,23.79) 7.75,23.79 8.4,23.79 ; 22.28,14.99 22.91,14.99 v1(22.99,14.9) ; C99.1 18.59,33.63 18.59,34.51 ; U7.R15 v1(34.74,28.2) ; U7.N4 v1(22.74,30.2) ; 18.37,18.33 18.37,17.95 17.85,17.43 17.85,17.1 ; 23.89,49.52 v1(23.13,49.52) ; v1(7.79,36.8) 7.88,36.8 C35.1 ; 20.55,68.25 v1(18.64,68.25) ; U7.E5 v1(23.74,39.2) ; 36.04,13.78 v1(36.04,15.02) ; 17.93,0.84 17.17,0.84 v1(17.16,0.85) ; C101.1 18.43,39.72 v1(17.57,39.72) 17.16,39.32 U29.P1 ; 29.29,20.04 29.29,20.05 v1(30.38,20.05) ; U29.B3 v1(15.36,29.32) ; v1(36.34,8.42) 36.33,8.43 v1(35.76,8.43) 35.44,8.43 35.19,8.18 35.19,7.52 ; 13.42,6.01 v1(13.42,5.21) ; 30.49,10.06 v1(30.49,10.87) ; 12.81,7.85 v1(12.81,8.54) ; U7.L6 v1(24.74,32.2) ; v1(31.21,10.92) 31.4,10.73 31.4,10.32 ; 26.16,48.23 26.16,47.49 ; U7.M5 v1(23.74,31.2) ; U7.J9 v1(28.74,34.2) ; 24.08,52.89 24.08,53.51 ; U7.H8 v1(26.74,36.2) ; 32.42,18.33 v1(32.42,18.9) ; 25.7,13.76 v1(25.7,14.91) ; 11.68,22.54 11.69,22.55 ; U7.J8 v1(26.74,34.2) ; 10.16,37.72 v1(9.66,38.22)
  SIG04 w0.381: 7.44,0.88 7.47,0.85 v1(17.16,0.85) 17.14,0.88 7.44,0.88 ; 7.44,0.88 v1(5.64,0.88) 4.14,0.88 4.03,0.98 2.83,0.98 v1(1.06,2.76) 0.83,2.99 0.83,4.05 0.64,4.23 0.64,5.38 v1(0.66,5.39) v1(0.66,7.34) v1(0.66,9.78) v1(0.66,11.73) v1(0.66,13.67) v1(0.66,15.62) v1(0.66,18.49) ; 7.44,0.88 5.78,2.54 ; 9.81,32.49 9.81,32.47 10.57,31.7 ; v1(26.56,0.77) 36.15,0.77 ; v1(44.64,16.72) v1(44.64,14.77) v1(44.64,12.83) v1(44.64,10.88) v1(44.64,8.53) v1(44.64,5.86) v1(44.64,3.98) 44.64,3.22 arc(44.53,2.84) 44.37,2.48 v1(43.75,1.87) 42.83,0.95 arc(42.64,0.86) 42.43,0.78 v1(41.84,0.78) 37.62,0.78 39.39,2.54
  POWER05 w0.381: 1.02,2.73 0.75,3 arc(0.74,3.01) 0.74,3.03 0.74,67.18 ; 44.65,16.72 44.65,65.23 44.65,65.27 ; v1(5.64,0.88) 5.54,0.98 2.64,0.98 1.06,2.57 v1(1.06,2.76) ; v1(36.15,0.78) v1(41.84,0.78) 42.43,0.78 arc(42.64,0.86) 42.83,0.95 v1(43.75,1.87) 44.37,2.48 arc(44.53,2.84) 44.64,3.22 v1(44.64,3.98) v1(44.64,5.86) v1(44.64,8.53) v1(44.64,10.88) v1(44.64,12.83) v1(44.64,14.77) v1(44.64,16.72) ; 44.65,65.27 44.63,65.28 ; 44.65,65.27 44.65,65.26 ; 44.65,65.27 44.6,66.05 44.46,66.19 44.46,67.58 ; 0.81,67.21 0.81,67.75 2.01,68.96 ; 44.46,67.58 v1(44.38,67.66) v1(42.42,69.63) 40.27,69.63 40.11,69.79 37.89,69.79 ; 3.75,69.72 2.93,69.72 arc(2.7,69.64) 2.47,69.54 1.97,69.03 ; 37.85,69.8 3.83,69.8 ; 26.56,0.78 36.15,0.78 ; 17.12,0.87 5.69,0.87
  Bottom Layer w0.254: v1(28.68,59.37) 28.68,60.78 29.27,61.37 ; 14.19,52.62 14.19,51.94 ; 31.07,65.17 v1(31.07,65.68) ; 35.07,59.19 35.07,58.86 35.32,58.6 36.41,58.6 ; 14.18,51.74 14.21,51.7 v1(14.21,51.19) ; v1(20.81,28.02) 20.5,27.71 19.94,27.71 18.09,25.86 18.09,25.3 17.15,24.36 v1(15.87,24.36) ; C128.1 C127.1
  Bottom Layer w0.381: C57.2 29.4,45.44 v1(29.08,45.76) ; 14.97,46.02 14.97,46.02 14.09,46.02 ; 26.54,2.68 25.16,2.68 25.1,2.74 ; v1(10.41,65.61) 10.4,65.62 9.34,65.62 ; v1(28.74,34.2) 29,34.46 C151.1 ; 15.98,46.12 v1(15.98,48.1) ; 26.77,54.78 27.4,54.78 28.03,54.15 ; 15.87,23.63 v1(15.87,24.36) ; 24.15,24.41 24.15,24.91 24.13,24.92 ; 27.61,35.42 26.84,36.2 v1(26.74,36.2) 26.02,36.2 25.72,35.9 C147.1 ; v1(9.76,39.72) 9.7,39.66 8.29,39.66 ; 34.48,41.49 34.22,41.22 33.69,41.22 ; 18.55,39.7 18.52,39.72 v1(17.57,39.72) ; C83.1 C137.2 ; 16.02,22.7 16.1,22.61 ; 16.1,22.61 16.1,23.5 ; 16.1,22.61 16.1,21.38 ; 23.23,25.24 23.23,24.45 ; 18.37,18.29 18.37,17.94 17.85,17.42 17.85,17.1 ; v1(9.76,32.52) 9.37,32.13 8.19,32.13 ; 34.39,26.03 34.18,26.24 v1(33.81,26.24) ; 20.93,42.38 20.92,42.38 v1(20.74,42.2) ; 20.93,42.38 22.66,42.38 23.06,41.99 23.06,42 23.53,42.48 ; 20.93,42.38 21.04,42.49 21.04,44.39 ; v1(8.77,28.82) 8.73,28.86 8.19,28.86 ; v1(9.76,33.32) 8.28,33.32 C33.1 ; v1(17.54,38.14) 17.91,37.77 18.56,37.77 ; v1(35.08,60.99) 35.07,60.98 Q1.2 NC1.1 ; 24.35,37.52 24.35,37.91 v1(24.64,38.2) 25.16,38.72 26.42,38.72 26.66,38.97 C144.1 26.91,39.31 27.31,39.71 27.31,41.14 27.49,41.32 ; v1(13.81,56.32) 13.81,55.52 13.79,55.5 ; v1(9.02,47.11) 9.02,46.06 C85.2 C139.2 ; v1(17.12,53.31) 16.76,53.67 16.76,53.87 ; 32.16,35.2 32.16,34.84 v1(32.81,34.2) 32.82,34.2 33.77,35.15 ; v1(10.98,48.32) 10.98,46.13 10.96,46.12 ; R131.1 10.1,35.21 v1(10.58,35.69) ; v1(26.74,34.2) 27,34.46 C161.1 ; 11.36,10.74 10.98,11.12 10.98,11.74 ; 24.79,64.85 v1(24.79,63.67) ; 21.02,3.07 20.22,3.07 20.06,2.91 ; 14.46,9.44 14.25,9.44 14.1,9.59 13.04,9.59 12.8,9.36 12.8,8.55 v1(12.81,8.54) ; v1(31.26,54.91) 31.26,55.08 C167.1 ; 23.96,55.95 24.39,55.52 v1(25.11,55.52) ; v1(20.81,28.02) 20.82,28.01 C159.1 ; 35.72,45.8 35.09,45.8 34.35,45.06 ; 9.18,7.16 9.18,7.74 9.85,8.41 9.85,9.29 10.16,9.6 11.34,9.6 v1(11.39,9.54) ; 22.48,25.28 22.48,24.45 ; 36.57,32.24 36.57,32.72 v1(36.57,32.73) ; v1(32.74,30.2) 32.59,30.35 32.06,30.35 ; C114.1 28.74,35.44 v1(28.74,36.2) ; v1(22.29,19.99) 26.51,19.99 26.93,20.41 v1(26.93,21.51) ; 8.46,41.89 8.62,41.89 9.13,41.38 v1(9.66,41.38) ; 16.05,23.56 16.11,23.5 ; v1(10.48,19.99) v1(11.03,19.99) v1(11.6,19.99) 12.26,19.99 C75.1 ; C127.1 27.49,41.32 ; 27.49,41.32 27.02,41.79 26.22,41.79 25.87,41.44 C91.1 ; C84.2 C23.2 ; 17.73,33.29 17.12,33.29 17.1,33.31 ; 8.21,36.8 v1(7.79,36.8) ; 18.44,41.89 18,41.89 17.57,41.46 v1(17.57,41.32) ; 11.3,9.85 11.3,10.37 ; 23.22,24.41 22.61,24.41 ; 14.95,48.19 15.06,48.09 15.06,46.14 ; 9.35,66.16 9.35,67.23 v1(9.34,67.24) ; 9.34,56.06 v1(9.34,57.39) ; 35.09,63.69 v1(34.59,63.69) ; 11.03,20.03 11.04,20.02
  vias: v1(0.66,65.2) v1(0.66,63.26) v1(0.66,61.31) v1(0.66,59.36) v1(0.66,57.42) v1(0.66,55.47) v1(0.66,53.52) v1(0.66,51.58) v1(0.66,49.63) v1(0.66,47.69) v1(0.66,45.74) v1(0.66,43.79) v1(0.66,41.85) v1(0.66,39.9) v1(0.66,37.95) v1(0.66,36.01) v1(0.66,34.06) v1(0.66,32.12) v1(0.66,30.17) v1(0.66,28.22) v1(0.66,26.28) v1(0.66,24.33) v1(0.66,22.38) v1(0.66,20.44) v1(0.76,67.15) v1(1.95,69.03) v1(3.73,69.72) v1(5.63,69.72) v1(7.52,69.72) v1(7.62,14.68) v1(7.62,14.13) v1(8.15,14.67) v1(8.14,14.13) v1(9.12,61.38) v1(9.42,69.72) v1(9.68,61.38) v1(11.31,69.72) v1(13.21,69.72) v1(14.42,9.41) v1(14.94,48.17) v1(15.02,69.72) v1(16.11,21.94) v1(16.11,21.41) v1(16.92,69.72) v1(17.1,12.44) v1(17.1,11.83) v1(17.37,17.08) v1(17.58,12.44) v1(17.58,11.83) v1(17.85,17.09) v1(18.07,12.44) v1(18.07,11.83) v1(18.81,69.72) v1(20.03,3.41) v1(20.03,2.92) v1(20.71,69.72) v1(21.24,62.68) v1(22.48,12.42) v1(22.48,11.11) v1(22.61,69.72) v1(24.09,52.85) v1(24.12,24.38) v1(24.5,69.72) v1(25.09,3.24) v1(25.09,2.75) v1(26.17,47.49) v1(26.98,50.01) v1(26.98,47.61) v1(26.99,46.6) v1(29.68,0.78) v1(30.28,69.82) v1(30.37,45.76) v1(30.91,32.18) v1(31.62,53.29) v1(31.88,47.62) v1(32.17,69.82) v1(32.36,0.78) v1(34.2,12.44) v1(34.21,11.6) v1(34.25,0.78) v1(35.05,12.44) v1(35.07,11.6) v1(35.91,12.44) v1(35.93,11.6) v1(36.4,58.64) v1(37.06,19.51) v1(37.86,69.82) v1(40.06,69.81) v1(44.64,65.17) v1(44.63,58.43) v1(44.63,56.55) v1(44.63,54.67) v1(44.63,52.79) v1(44.63,50.92) v1(44.63,49.04) v1(44.64,47.16) v1(44.64,45.28) v1(44.64,43.41) v1(44.64,41.53) v1(44.64,39.65) v1(44.64,37.77) v1(44.64,35.9) v1(44.64,34.02) v1(44.64,32.14) v1(44.64,30.26) v1(44.64,28.39) v1(44.64,26.51) v1(44.64,24.63) v1(44.64,22.75) v1(44.64,20.88) v1(44.64,19)
